# EAGLE schematic mfl_modul_u6052b (EAGLE 8.5.1)
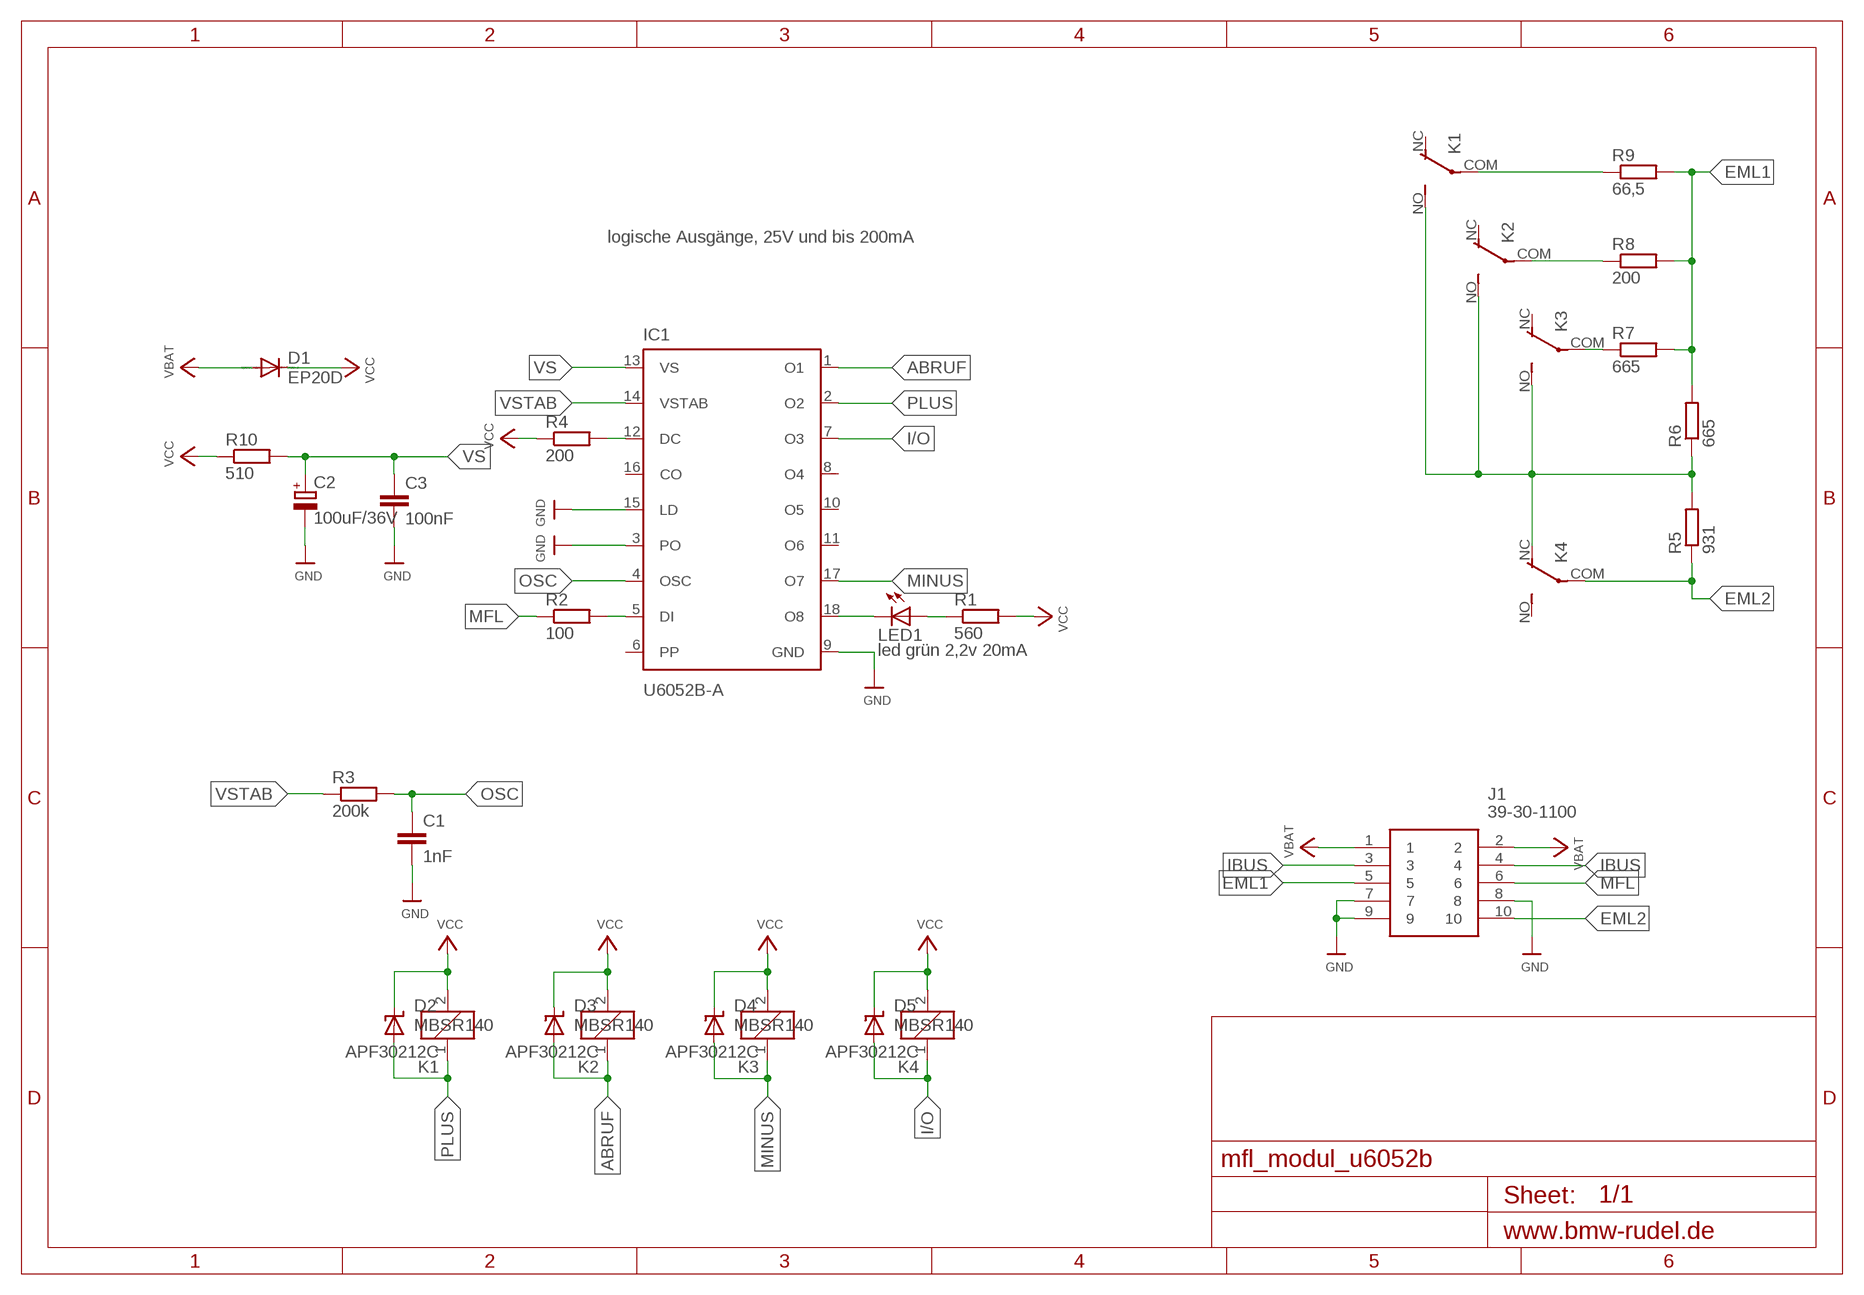
[diagram p0: schematic, sheet 1]

## Parts
C1  1nF  C-EU025-025X050  [C025-025X050]
C2  100uF/36V  CPOL-EUE2.5-6  [E2,5-6]
C3  100nF  C-EU025-025X050  [C025-025X050]
D1  EP20D  DIODE-DO15-12  [DO15-12]
D2  MBSR140  SHOTKY-SMDSMB  [DO214AA]
D3  MBSR140  SHOTKY-SMDSMB  [DO214AA]
D4  MBSR140  SHOTKY-SMDSMB  [DO214AA]
D5  MBSR140  SHOTKY-SMDSMB  [DO214AA]
IC1  U6052B-A  [DIL18]
J1  39-30-1100  [39-30-1100]
K1  APF30212C  [APF30212C]
K2  APF30212C  [APF30212C]
K3  APF30212C  [APF30212C]
K4  APF30212C  [APF30212C]
LED1  led grün 2,2v 20mA  LED3MM  [LED3MM]
R1  560  R-EU_0207/7  [0207/7]
R2  100  R-EU_0207/7  [0207/7]
R3  200k  R-EU_0207/7  [0207/7]
R4  200  R-EU_0207/7  [0207/7]
R5  931  R-EU_0207/7  [0207/7]
R6  665  R-EU_0207/7  [0207/7]
R7  665  R-EU_0207/7  [0207/7]
R8  200  R-EU_0207/7  [0207/7]
R9  66,5  R-EU_0207/7  [0207/7]
R10  510  R-EU_0207/7  [0207/7]

## Nets
ABRUF: D3.A IC1.1(O1) K2.1
EML1: J1.5 R6.2 R7.2 R8.2 R9.2
EML2: J1.10 K4.COM(2:P) R5.1
GND: C1.2 C2.- C3.2 IC1.3(PO) IC1.9(GND) IC1.15(LD) J1.7 J1.8 J1.9
I/O: D5.A IC1.7(O3) K4.1
IBUS: J1.3 J1.4
MFL: J1.6 R2.1
MINUS: D4.A IC1.17(O7) K3.1
N$1: IC1.5(DI) R2.2
N$2: IC1.12(DC) R4.2
N$3: LED1.A R1.1
N$4: IC1.18(O8) LED1.K(C)
N$9: K1.COM(2:P) R9.1
N$10: K2.COM(2:P) R8.1
N$11: K3.COM(2:P) R7.1
N$12: K1.NO(2:S) K2.NO(2:S) K3.NO(2:S) K4.NC(2:O) R5.2 R6.1
OSC: C1.1 IC1.4(OSC) R3.2
PLUS: D2.A IC1.2(O2) K1.1
VBAT: D1.A J1.1 J1.2
VCC: D1.C D2.C D3.C D4.C D5.C K1.2 K2.2 K3.2 K4.2 R1.2 R4.1 R10.1
VS: C2.+ C3.1 IC1.13(VS) R10.2
VSTAB: IC1.14(VSTAB) R3.1
Unconnected: IC1.6(PP) IC1.8(O4) IC1.10(O5) IC1.11(O6) IC1.16(CO) K1.NC(2:O) K2.NC(2:O) K3.NC(2:O) K4.NO(2:S)

## Notes on the sheet
- logische Ausgänge, 25V und bis 200mA

## Library data of the parts
C1 C3 = rcl:C-EU: CAPACITOR, European symbol; SPICEPREFIX: C
C2 = rcl:CPOL-EU: POLARIZED CAPACITOR, European symbol; SPICEPREFIX: C
D1 = diode:DIODE-: DIODE
D2-D5 = Heinrich:SHOTKY-SMD
IC1 = Heinrich:U6052B
J1 = Heinrich:39-30-1100: 10 way r/a PCB header w/peg,Mini-Fit Jr Molex MINI-FIT JR. Series, Series Number 5569, 4.2mm Pitch 10 Way 2 Row Shrouded Right Angle PCB Header, Through Hole Source: Datasheet <http://www.molex.com/webdocs/datasheets/pdf/en-us//0039301100_PCB_HEADERS.pdf>; ALLIED_NUMBER: 70190658; ALLIED_PRICE-STOCK: https://www.alliedelec.com/molex-incorporated-39-30-1100/70190658/; DESCRIPTION: 10 way r/a PCB header w/peg,Mini-Fit Jr Molex MINI-FIT JR. Series, Series Number 5569, 4.2mm Pitch 10 Way 2 Row Shrouded Right Angle PCB Header, Through Hole; HEIGHT: mm; MANUFACTURER_NAME: Molex; MANUFACTURER_PART_NUMBER: 39-30-1100; MOUSER_PART_NUMBER: 538-39-30-1100; MOUSER_PRICE-STOCK: https://www.mouser.com/Search/Refine.aspx?Keyword=538-39-30-1100; RS_PART_NUMBER: 5109871P; RS_PRICE-STOCK: http://uk.rs-online.com/web/p/products/5109871P
K1-K4 = relay:APF30212C: Compliant with European standards 1a/1c 6A Slim power relays Source: Data sheet <http://pewa.panasonic.com/assets/pcsd/catalog/pf-catalog.pdf>; OC_FARNELL: unknown
LED1 = led:LED: LED OSRAM: - CHIPLED LG R971, LG N971, LY N971, LG Q971, LY Q971, LO R971, LY R971 LH N974, LH R974 LS Q976, LO Q976, LY Q976 LO Q996 - Hyper CHIPLED LW Q18S LB Q993, LB Q99A, LB R99A - SideLED LS A670, LO A670, LY A670, LG A670, LP A670 LB A673, LV A673, LT A673, LW A673 LH A674 LY A675 LS A676, LA A676, LO A676, LY A676, LW A676 LS A679, LY A679, LG A679 - Hyper Micro SIDELED® LS Y876, LA Y876, LO Y876, LY Y876 LT Y87S - SmartLED LW L88C, LW L88S LB L89C, LB L89S, LG L890 LS L89K, LO L89K, LY L89K LS L896, LA L896, LO L896, LY L896 - TOPLED LS T670, LO T670, LY T670, LG T670, LP T670 LSG T670, LSP T670, LSY T670, LOP T670, LYG T670 LG T671, LOG T671, LSG T671 LB T673, LV T673, LT T673, LW T673 LH T674 LS T676, LA T676, LO T676, LY T676, LB T676, LH T676, LSB T676, LW T676 LB T67C, LV T67C, LT T67C, LS T67K, LO T67K, LY T67K, LW E67C LS E67B, LA E67B, LO E67B, LY E67B, LB E67C, LV E67C, LT E67C LW T67C LS T679, LY T679, LG T679 LS T770, LO T770, LY T770, LG T770, LP T770 LB T773, LV T773, LT T773, LW T773 LH T774 LS E675, LA E675, LY E675, LS T675 LS T776, LA T776, LO T776, LY T776, LB T776 LHGB T686 LT T68C, LB T68C - Hyper Mini TOPLED® LB M676 - Mini TOPLED Santana® LG M470 LS M47K, LO M47K, LY M47K Source: http://www.osram.convergy.de LUXEON: - LUMILED® LXK2-PW12-R00, LXK2-PW12-S00, LXK2-PW14-U00, LXK2-PW14-V00 LXK2-PM12-R00, LXK2-PM12-S00, LXK2-PM14-U00 LXK2-PE12-Q00, LXK2-PE12-R00, LXK2-PE12-S00, LXK2-PE14-T00, LXK2-PE14-U00 LXK2-PB12-K00, LXK2-PB12-L00, LXK2-PB12-M00, LXK2-PB14-N00, LXK2-PB14-P00, LXK2-PB14-Q00 LXK2-PR12-L00, LXK2-PR12-M00, LXK2-PR14-Q00, LXK2-PR14-R00 LXK2-PD12-Q00, LXK2-PD12-R00, LXK2-PD12-S00 LXK2-PH12-R00, LXK2-PH12-S00 LXK2-PL12-P00, LXK2-PL12-Q00, LXK2-PL12-R00 Source: www.luxeon.com KINGBRIGHT: KA-3528ASYC Source: www.kingbright.com
R1-R10 = rcl:R-EU_: RESISTOR, European symbol; SPICEPREFIX: R